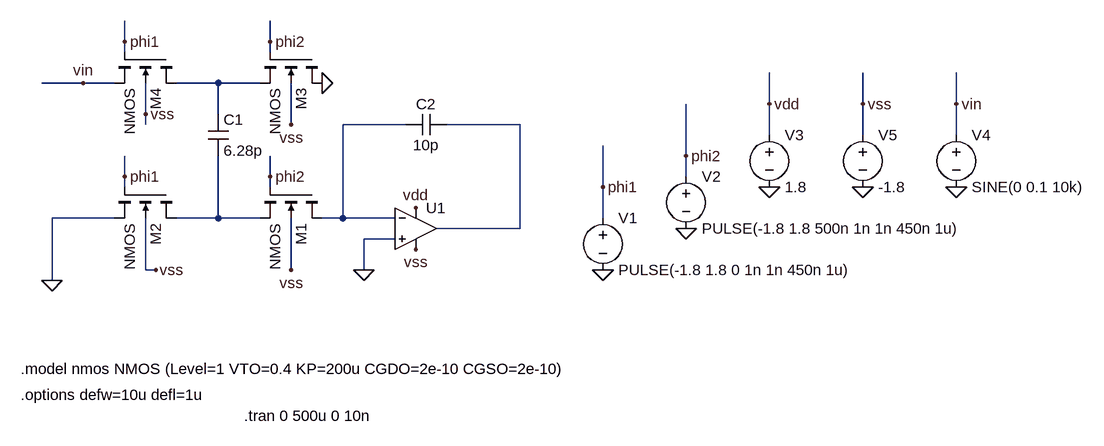
[diagram p0: schematic SC_Integrator.asc]
SC_Integrator.asc, the LTspice schematic file:
Version 4
SHEET 1 1236 680
WIRE -256 -80 -256 -112
WIRE -32 -80 -32 -112
WIRE -256 -64 -256 -80
WIRE -32 -64 -32 -80
WIRE -320 -16 -384 -16
WIRE -272 -16 -320 -16
WIRE -112 -16 -176 -16
WIRE -48 -16 -112 -16
WIRE 736 16 736 -32
WIRE 880 16 880 -32
WIRE 1024 16 1024 -32
WIRE -224 32 -224 -16
WIRE -112 32 -112 -16
WIRE -224 48 -224 32
WIRE 0 48 0 -16
WIRE 176 48 80 48
WIRE 352 48 240 48
WIRE 736 64 736 16
WIRE 880 64 880 16
WIRE 1024 64 1024 16
WIRE 608 96 608 16
WIRE -256 128 -256 96
WIRE -32 128 -32 96
WIRE 608 128 608 96
WIRE -256 144 -256 128
WIRE -32 144 -32 128
WIRE 480 144 480 80
WIRE -272 192 -368 192
WIRE -112 192 -112 96
WIRE -112 192 -176 192
WIRE -48 192 -112 192
WIRE 80 192 80 48
WIRE 80 192 48 192
WIRE 160 192 80 192
WIRE 480 192 480 144
WIRE 352 208 352 48
WIRE 352 208 224 208
WIRE 160 224 112 224
WIRE -224 272 -224 192
WIRE -208 272 -224 272
WIRE 0 272 0 192
WIRE 112 272 112 224
WIRE -368 288 -368 192
FLAG 112 272 0
FLAG -368 288 0
FLAG 480 272 0
FLAG 608 208 0
FLAG 736 144 0
FLAG -256 -80 phi1
FLAG -256 128 phi1
FLAG 480 144 phi1
FLAG -32 -80 phi2
FLAG -32 128 phi2
FLAG 608 96 phi2
FLAG 192 176 vdd
FLAG 736 16 vdd
FLAG 1024 144 0
FLAG 1024 16 vin
FLAG -320 -16 vin
FLAG 880 144 0
FLAG 192 240 vss
FLAG 880 16 vss
FLAG -224 32 vss
FLAG 0 48 vss
FLAG 0 272 vss
FLAG -208 272 vss
FLAG 48 -16 0
SYMBOL OpAmps\\UniversalOpAmp2 192 208 R0
SYMATTR InstName U1
SYMBOL nmos4 48 144 R90
SYMATTR InstName M1
SYMATTR Value2 l=1u w=10u
SYMBOL nmos4 -176 144 R90
SYMATTR InstName M2
SYMATTR Value2 l=1u w=10u
SYMBOL nmos4 48 -64 R90
SYMATTR InstName M3
SYMATTR Value2 l=1u w=10u
SYMBOL nmos4 -176 -64 R90
SYMATTR InstName M4
SYMATTR Value2 l=1u w=10u
SYMBOL cap -128 32 R0
SYMATTR InstName C1
SYMATTR Value 6.28p
SYMBOL cap 240 32 R90
WINDOW 0 0 32 VBottom 2
WINDOW 3 32 32 VTop 2
SYMATTR InstName C2
SYMATTR Value 10p
SYMBOL voltage 480 176 R0
WINDOW 123 0 0 Left 0
WINDOW 39 0 0 Left 0
SYMATTR InstName V1
SYMATTR Value PULSE(-1.8 1.8 0 1n 1n 450n 1u)
SYMBOL voltage 608 112 R0
WINDOW 123 0 0 Left 0
WINDOW 39 0 0 Left 0
SYMATTR InstName V2
SYMATTR Value PULSE(-1.8 1.8 500n 1n 1n 450n 1u)
SYMBOL voltage 736 48 R0
WINDOW 123 0 0 Left 0
WINDOW 39 0 0 Left 0
SYMATTR InstName V3
SYMATTR Value 1.8
SYMBOL voltage 1024 48 R0
WINDOW 123 0 0 Left 0
WINDOW 39 0 0 Left 0
SYMATTR InstName V4
SYMATTR Value SINE(0 0.1 10k)
SYMBOL voltage 880 48 R0
WINDOW 123 0 0 Left 0
WINDOW 39 0 0 Left 0
SYMATTR InstName V5
SYMATTR Value -1.8
TEXT -416 424 Left 2 !.model nmos NMOS (Level=1 VTO=0.4 KP=200u CGDO=2e-10 CGSO=2e-10)
TEXT -72 496 Left 2 !.tran 0 500u 0 10n
TEXT -416 464 Left 2 !.options defw=10u defl=1u

The netlist it stands for:
* SC_Integrator.asc
XU1 0 N002 vdd vss N003 level2 Avol=1Meg GBW=10Meg Slew=10Meg Ilimit=25m Rail=0 Vos=0 En=0 Enk=0 In=0 Ink=0 Rin=500Meg  ; pins In+ In- V+ V- OUT
M1 N002 phi2 N004 vss NMOS l=1u w=10u
M2 N004 phi1 0 vss NMOS l=1u w=10u
M3 0 phi2 N001 vss NMOS l=1u w=10u
M4 N001 phi1 vin vss NMOS l=1u w=10u
C1 N001 N004 6.28p
C2 N003 N002 10p
V1 phi1 0 PULSE(-1.8 1.8 0 1n 1n 450n 1u)
V2 phi2 0 PULSE(-1.8 1.8 500n 1n 1n 450n 1u)
V3 vdd 0 1.8
V4 vin 0 SINE(0 0.1 10k)
V5 vss 0 -1.8
.model NMOS NMOS
.model PMOS PMOS
.lib standard.mos
.model nmos NMOS (Level=1 VTO=0.4 KP=200u CGDO=2e-10 CGSO=2e-10)
.tran 0 500u 0 10n
.options defw=10u defl=1u
.lib UniversalOpAmp2.lib
.backanno
.end